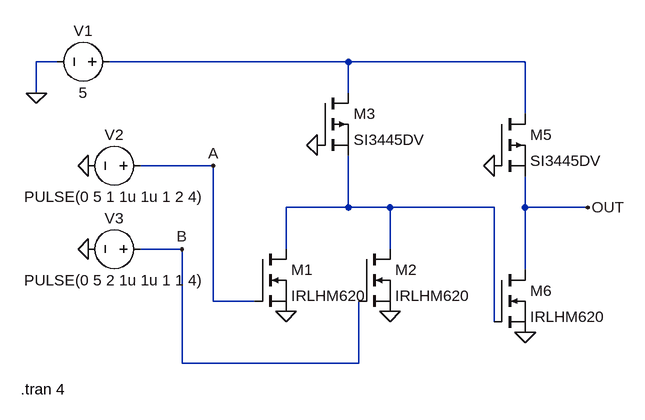
[diagram p0: schematic OR PSEUDO.asc]
OR PSEUDO.asc, the LTspice schematic file:
Version 4.1
SHEET 1 880 680
WIRE -128 -16 -160 -16
WIRE 320 -16 -48 -16
WIRE 592 -16 320 -16
WIRE -160 32 -160 -16
WIRE 320 32 320 -16
WIRE 592 64 592 -16
WIRE 112 144 0 144
WIRE 320 208 320 128
WIRE 320 208 224 208
WIRE 384 208 320 208
WIRE 544 208 384 208
WIRE 592 208 592 160
WIRE 688 208 592 208
WIRE 64 272 0 272
WIRE 224 272 224 208
WIRE 384 272 384 208
WIRE 592 304 592 208
WIRE 112 352 112 144
WIRE 176 352 112 352
WIRE 544 384 544 208
WIRE 64 448 64 272
WIRE 336 448 336 352
WIRE 336 448 64 448
FLAG -160 32 0
FLAG -80 144 0
FLAG -80 272 0
FLAG 112 144 A
FLAG 64 272 B
FLAG 592 400 0
FLAG 224 368 0
FLAG 384 368 0
FLAG 688 208 OUT
FLAG 272 112 0
FLAG 544 144 0
SYMBOL voltage -32 -16 R90
WINDOW 0 -32 56 VBottom 2
WINDOW 3 32 56 VTop 2
WINDOW 123 0 0 Left 0
WINDOW 39 0 0 Left 0
SYMATTR InstName V1
SYMATTR Value 5
SYMBOL voltage 16 144 R90
WINDOW 0 -32 56 VBottom 2
WINDOW 3 32 56 VTop 2
WINDOW 123 0 0 Left 0
WINDOW 39 0 0 Left 0
SYMATTR InstName V2
SYMATTR Value PULSE(0 5 1 1u 1u 1 2 4)
SYMBOL voltage 16 272 R90
WINDOW 0 -32 56 VBottom 2
WINDOW 3 32 56 VTop 2
WINDOW 123 0 0 Left 0
WINDOW 39 0 0 Left 0
SYMATTR InstName V3
SYMATTR Value PULSE(0 5 2 1u 1u 1 1 4)
SYMBOL pmos 544 64 R0
SYMATTR InstName M5
SYMATTR Value SI3445DV
SYMBOL nmos 544 304 R0
SYMATTR InstName M6
SYMATTR Value IRLHM620
SYMBOL nmos 176 272 R0
SYMATTR InstName M1
SYMATTR Value IRLHM620
SYMBOL nmos 336 272 R0
SYMATTR InstName M2
SYMATTR Value IRLHM620
SYMBOL pmos 272 32 R0
SYMATTR InstName M3
SYMATTR Value SI3445DV
TEXT -184 488 Left 2 !.tran 4

The netlist it stands for:
* OR PSEUDO.asc
V1 N001 0 5
V2 A 0 PULSE(0 5 1 1u 1u 1 2 4)
V3 B 0 PULSE(0 5 2 1u 1u 1 1 4)
M5 N001 0 OUT OUT SI3445DV
M6 OUT N002 0 0 IRLHM620
M1 N002 A 0 0 IRLHM620
M2 N002 B 0 0 IRLHM620
M3 N001 0 N002 N002 SI3445DV
.model NMOS NMOS
.model PMOS PMOS
.lib standard.mos
.tran 4
.backanno
.end